# Altium schematic sheet 02_FPC_INPUT_CON.SchDoc: FPC input connector
size 420 x 297 mm; SheetNumber: 4; SheetTotal: 5; DocSize: DINA3
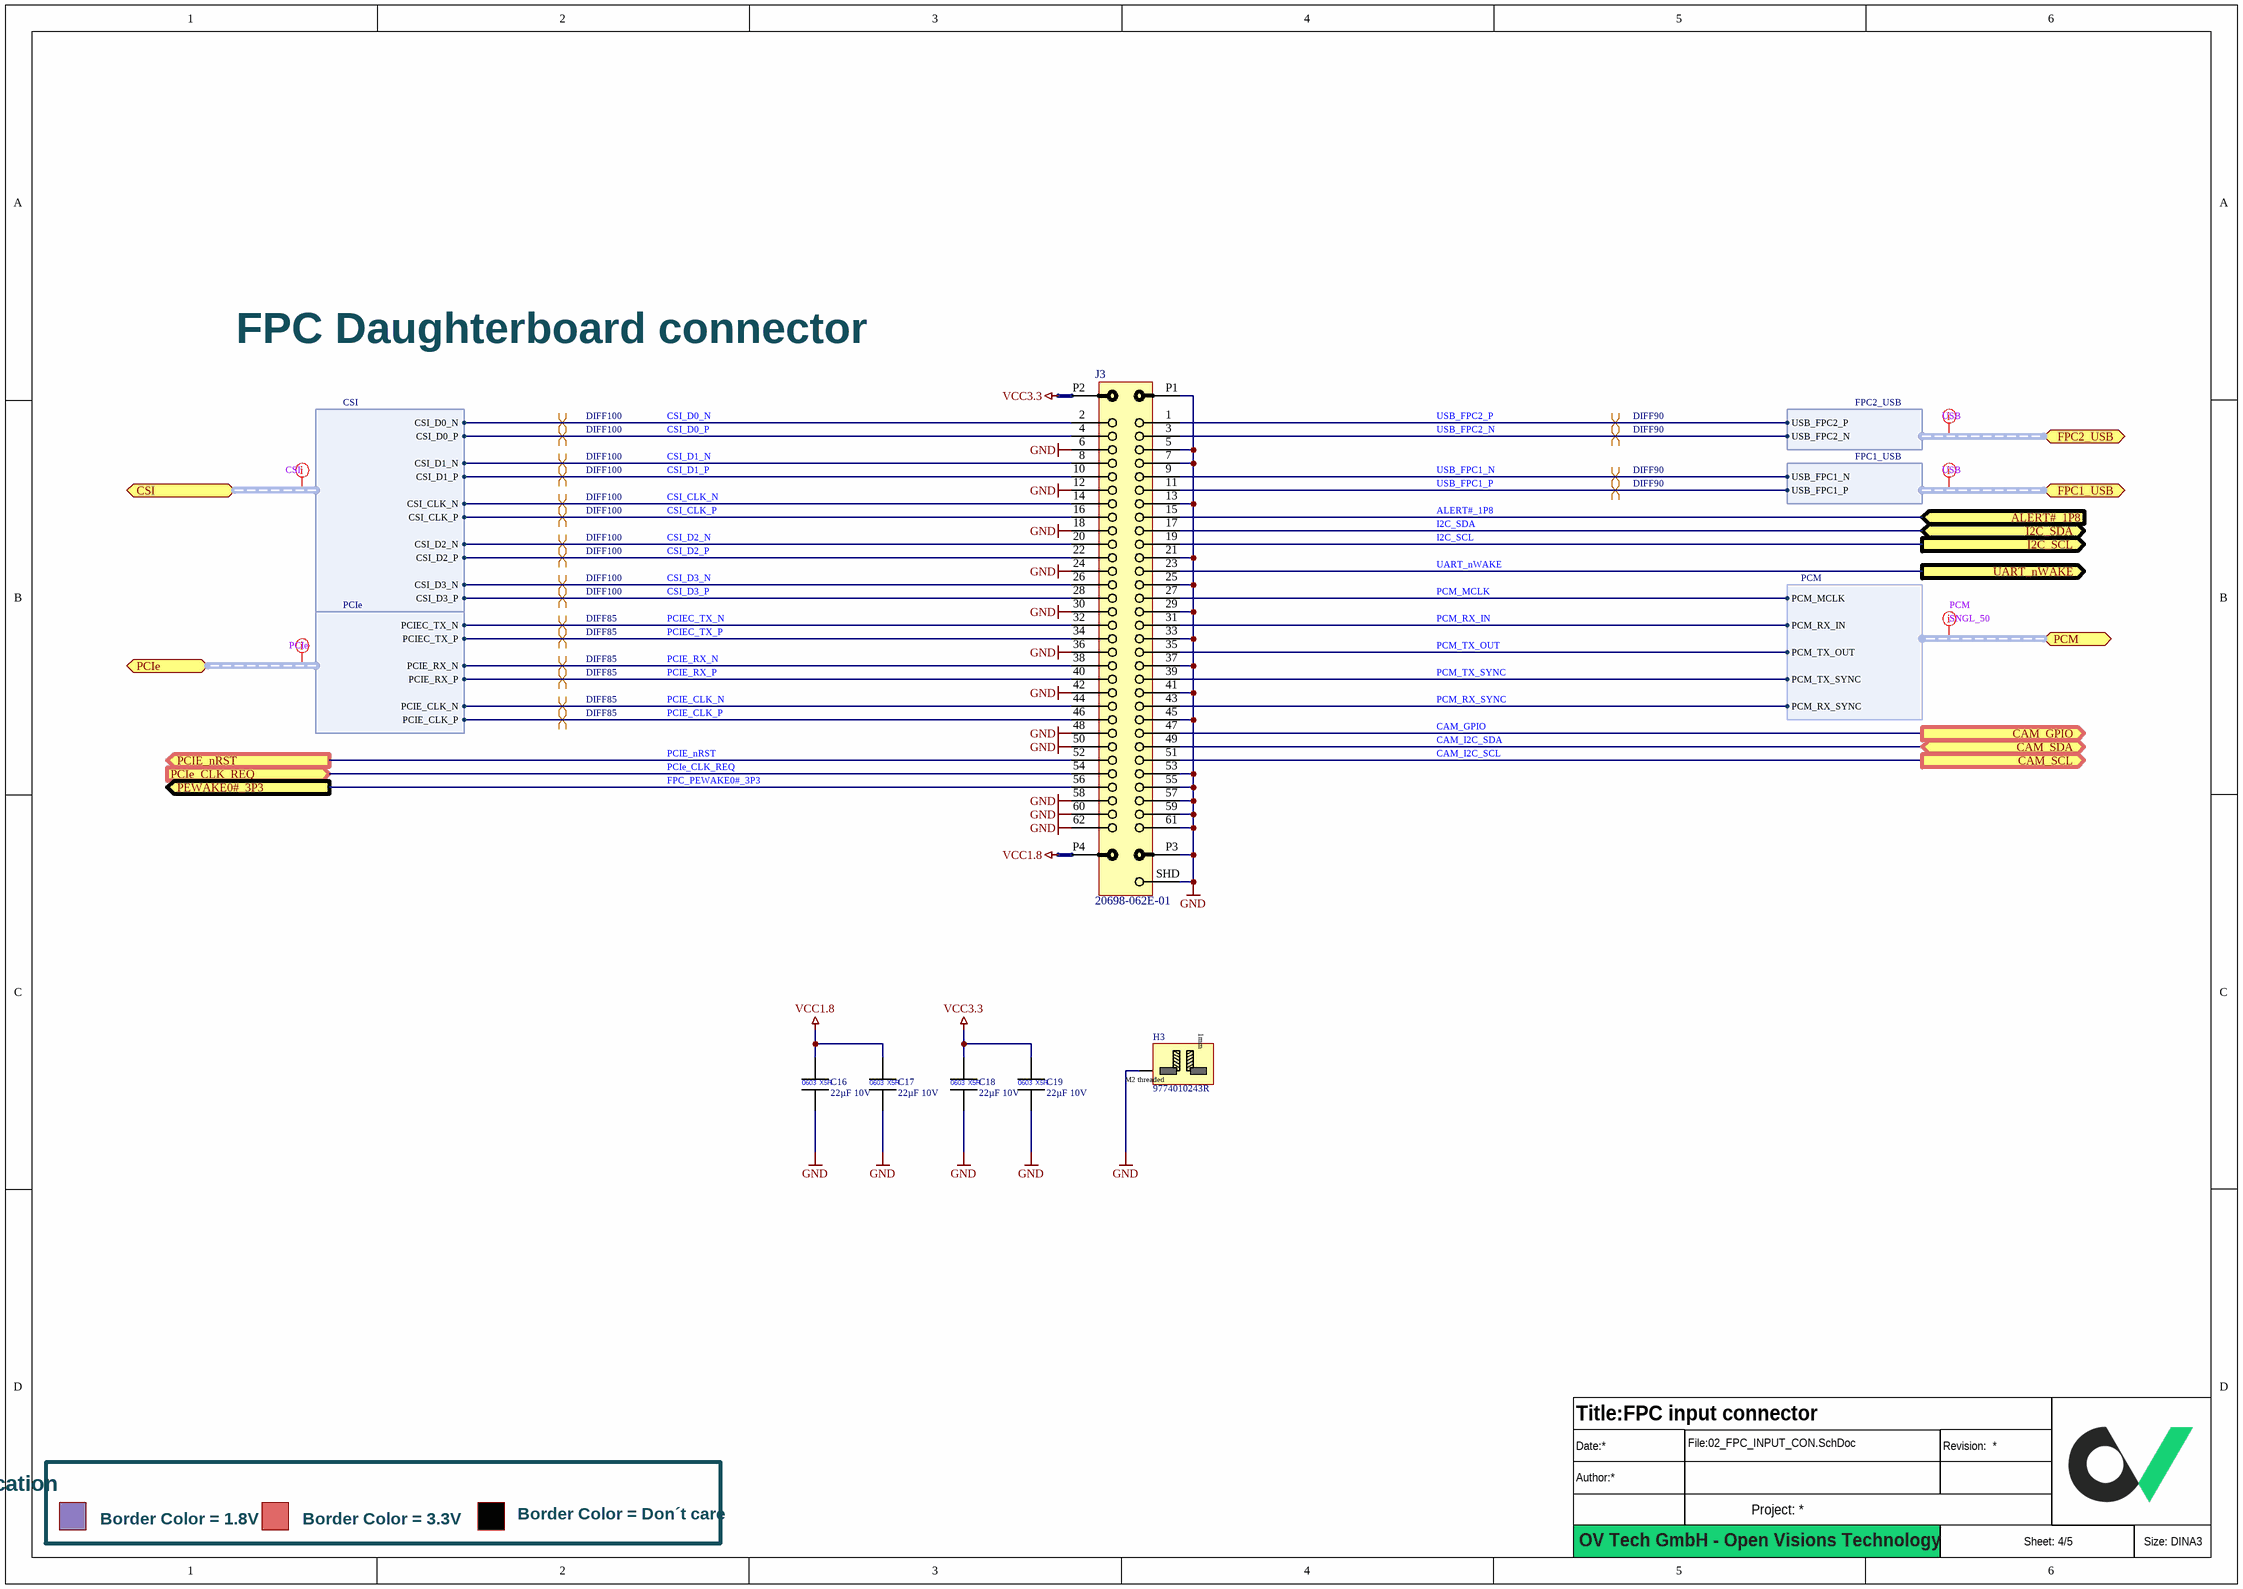
[diagram p0: 02_FPC_INPUT_CON.SchDoc]

## Parts
?  (no value)  (graphical)
C16  22µF 10V  [CAPC1608X10L]
C17  22µF 10V  [CAPC1608X10L]
C18  22µF 10V  [CAPC1608X10L]
C19  22µF 10V  [CAPC1608X10L]
H3  9774010243R  [Spacer_SMD_M2x1_9774010243R]
J3  20698-062E-01  [BOARD-TO-BOARD 62POL_20698-062E-01]

## Ports
ALERT#_1P8 (in), CAM_GPIO (out), CAM_SCL (out), CAM_SDA (bidir), CSI (bidir, harness CSI), FPC1_USB (bidir, harness FPC1_USB), FPC2_USB (bidir, harness FPC2_USB), I2C_SCL (out), I2C_SDA (bidir), PCIe (bidir, harness PCIe), PCIe_CLK_REQ (in), PCIE_nRST (out), PCM (bidir, harness PCM), PEWAKE0#_3P3 (out), UART_nWAKE (out)

## Harnesses
CSI: CSI_D0_N, CSI_D0_P, CSI_D1_N, CSI_D1_P, CSI_CLK_N, CSI_CLK_P, CSI_D2_N, CSI_D2_P, CSI_D3_N, CSI_D3_P
PCIe: PCIE_CLK_N, PCIE_CLK_P, PCIEC_TX_N, PCIE_RX_P, PCIE_RX_N, PCIEC_TX_P
FPC1_USB: USB_FPC1_P, USB_FPC1_N
FPC2_USB: USB_FPC2_P, USB_FPC2_N
PCM: PCM_MCLK, PCM_TX_OUT, PCM_RX_IN, PCM_TX_SYNC, PCM_RX_SYNC

## Nets
GND: C16.2 C17.2 C18.2 C19.2 H3.MT J3.5 J3.6 J3.7 J3.12 J3.13 J3.18 J3.21 J3.24 J3.25 J3.29 J3.30 J3.33 J3.36 J3.37 J3.41 J3.42 J3.45 J3.48 J3.50 J3.53 J3.55 J3.57 J3.58 J3.59 J3.60 J3.61 J3.62 J3.P1 J3.P3 J3.SHD
VCC1.8: C16.1 C17.1 J3.P4
VCC3.3: C18.1 C19.1 J3.P2
ALERT#_1P8: J3.15 ; port ALERT#_1P8
CAM_GPIO: J3.47 ; port CAM_GPIO
CAM_I2C_SCL: J3.51 ; port CAM_SCL
CAM_I2C_SDA: J3.49 ; port CAM_SDA
CSI_CLK_N: J3.14 ; port CSI.CSI_CLK_N
CSI_CLK_P: J3.16 ; port CSI.CSI_CLK_P
CSI_D0_N: J3.2 ; port CSI.CSI_D0_N
CSI_D0_P: J3.4 ; port CSI.CSI_D0_P
CSI_D1_N: J3.8 ; port CSI.CSI_D1_N
CSI_D1_P: J3.10 ; port CSI.CSI_D1_P
CSI_D2_N: J3.20 ; port CSI.CSI_D2_N
CSI_D2_P: J3.22 ; port CSI.CSI_D2_P
CSI_D3_N: J3.26 ; port CSI.CSI_D3_N
CSI_D3_P: J3.28 ; port CSI.CSI_D3_P
FPC_PEWAKE0#_3P3: J3.56 ; port PEWAKE0#_3P3
I2C_SCL: J3.19 ; port I2C_SCL
I2C_SDA: J3.17 ; port I2C_SDA
PCIE_CLK_N: J3.44 ; port PCIe.PCIE_CLK_N
PCIE_CLK_P: J3.46 ; port PCIe.PCIE_CLK_P
PCIe_CLK_REQ: J3.54 ; port PCIe_CLK_REQ
PCIE_nRST: J3.52 ; port PCIE_nRST
PCIE_RX_N: J3.38 ; port PCIe.PCIE_RX_N
PCIE_RX_P: J3.40 ; port PCIe.PCIE_RX_P
PCIEC_TX_N: J3.32 ; port PCIe.PCIEC_TX_N
PCIEC_TX_P: J3.34 ; port PCIe.PCIEC_TX_P
PCM_MCLK: J3.27 ; port PCM.PCM_MCLK
PCM_RX_IN: J3.31 ; port PCM.PCM_RX_IN
PCM_RX_SYNC: J3.43 ; port PCM.PCM_RX_SYNC
PCM_TX_OUT: J3.35 ; port PCM.PCM_TX_OUT
PCM_TX_SYNC: J3.39 ; port PCM.PCM_TX_SYNC
UART_nWAKE: J3.23 ; port UART_nWAKE
USB_FPC1_N: J3.9 ; port FPC1_USB.USB_FPC1_N
USB_FPC1_P: J3.11 ; port FPC1_USB.USB_FPC1_P
USB_FPC2_N: J3.3 ; port FPC2_USB.USB_FPC2_N
USB_FPC2_P: J3.1 ; port FPC2_USB.USB_FPC2_P

## Layout directives
net class CSI: (no net found under the mark)
differential pair; differential pair class DIFF100: CSI_CLK_N, CSI_CLK_P, CSI_D0_N, CSI_D0_P, CSI_D1_N, CSI_D1_P, CSI_D2_N, CSI_D2_P, CSI_D3_N, CSI_D3_P
net class PCIe: (no net found under the mark)
differential pair; differential pair class DIFF85: PCIE_CLK_N, PCIE_CLK_P, PCIE_RX_N, PCIE_RX_P, PCIEC_TX_N, PCIEC_TX_P
net class USB: (no net found under the mark)
differential pair; differential pair class DIFF90: USB_FPC1_N, USB_FPC1_P, USB_FPC2_N, USB_FPC2_P
net class PCM; net class SNGL_50: (no net found under the mark)

## Notes on the sheet
- (near J3) FPC Daughterboard connector
- Signal Level Indication
- Border Color = 1.8V
- Border Color = 3.3V
- Border Color = Don´t care
- OV Tech GmbH - Open Visions Technology
- (in symbol CAP_0603_22µ_10V) 0603; X5R
- (in symbol Spacer_SMD_M2_internal_1mm) 1mm; M2 threaded

## Library data of the parts
? = Titleblock_01_OpenSource
C16-C19 = CAP_0603_22µ_10V: Multilayer Ceramic Capacitors MLCC - SMD/SMT 0603 10VDC; Manufacturer 1: Murata Electronics; Manufacturer 1 Prt. Nr.: GRM188R61A226ME15D; Manufacturer 2 Prt. Nr.: CL10A226MP8NRNC; Manufacturer 2: Samsung Electro-Mechanics
H3 = Spacer_SMD_M2_internal_1mm: Würth Elektronik SMD Spacer M2 1mm length; Manufacturer 1: Würth Elektronik; Manufacturer 1 Prt. Nr.: 9774010243R
J3 = Board to Board Connector_62pol_20698-062E-01: Board to Board connector 62Pol FPC Header 0.35mm Pitch; Manufacturer 1: I-PEX; Manufacturer 1 Prt. Nr.: 20698-062E-01